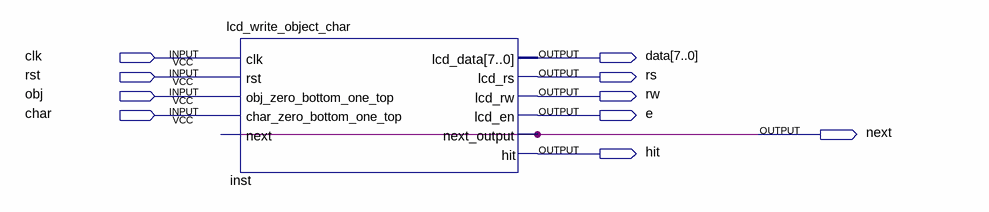
[diagram p0: schematic sheet]
// Quartus schematic write_char_obj_test.bdf as structural Verilog: 1 symbols, 10 pins
module write_char_obj_test (
  input  clk,
  input  rst,
  input  obj,
  input  char,
  output [7:0] data,
  output rs,
  output rw,
  output e,
  output next,
  output hit
);

  lcd_write_object_char inst (
    .clk(clk), .rst(rst), .obj_zero_bottom_one_top(obj), .char_zero_bottom_one_top(char), .next(next),
    .lcd_data(data), .lcd_rs(rs), .lcd_rw(rw), .lcd_en(e), .next_output(next), .hit(hit));
endmodule
